# Altium schematic sheet Main.SchDoc
size Tabloid; SheetNumber: 1; SheetTotal: 1; Sheet_Name: Main schematics file; Size: 11x17
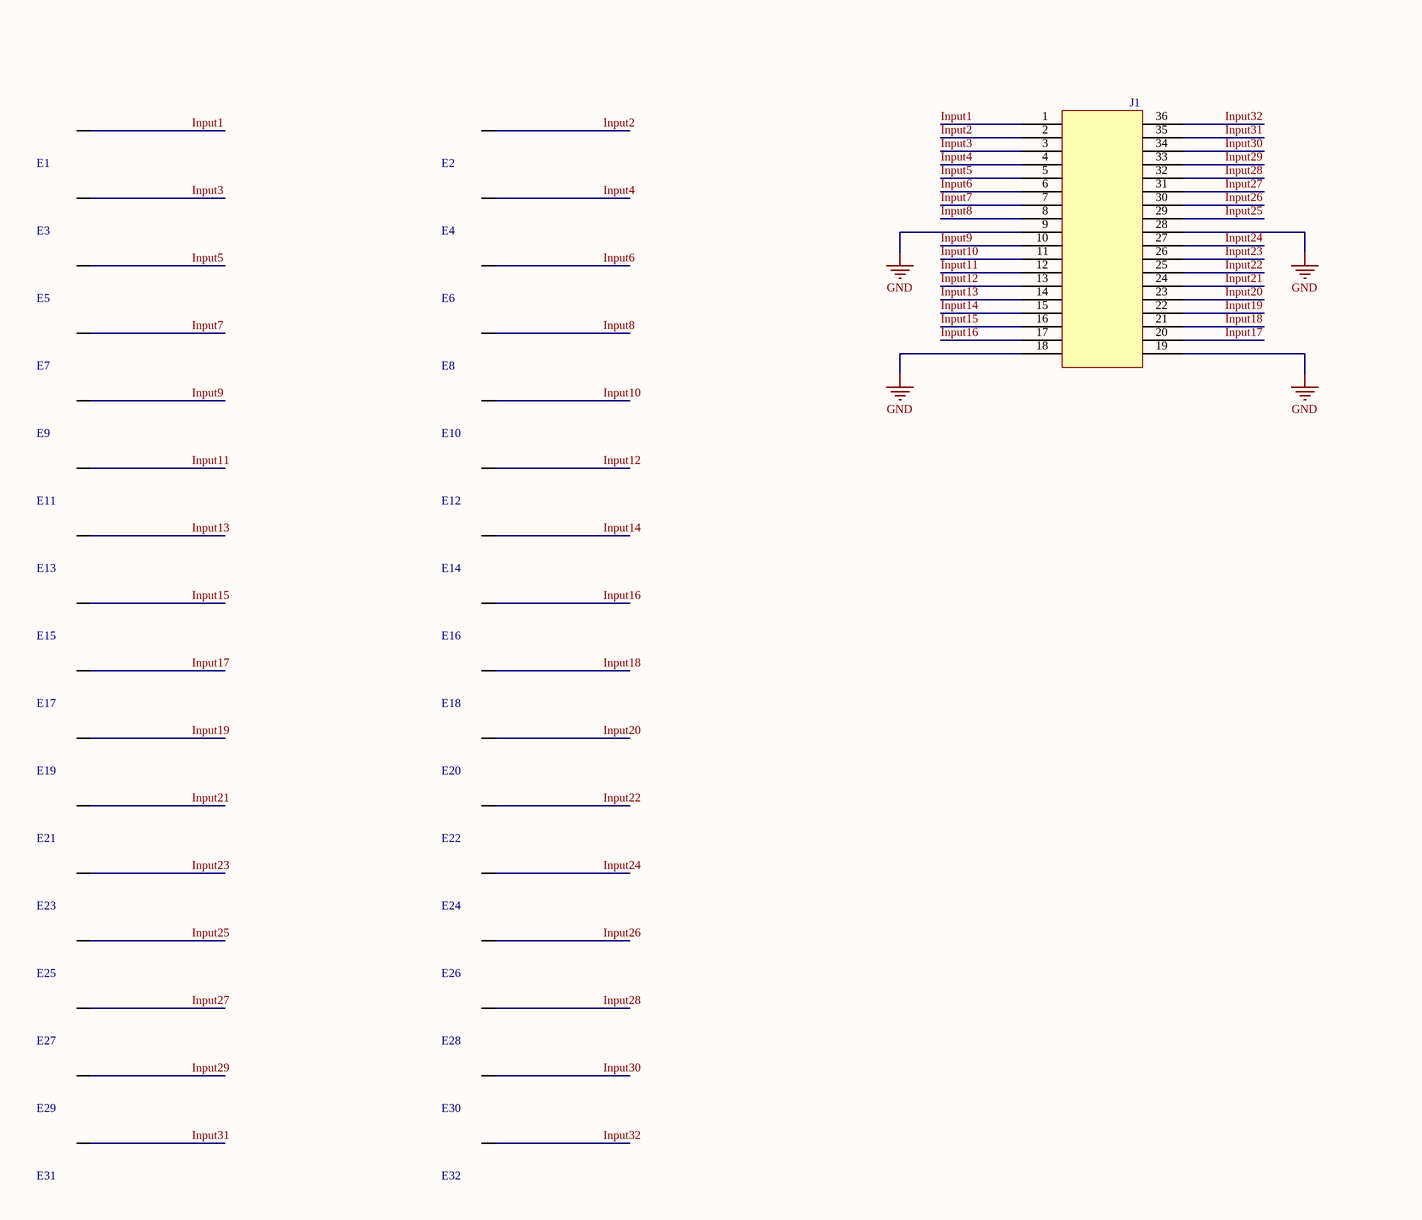
[diagram p0: Main.SchDoc, left]
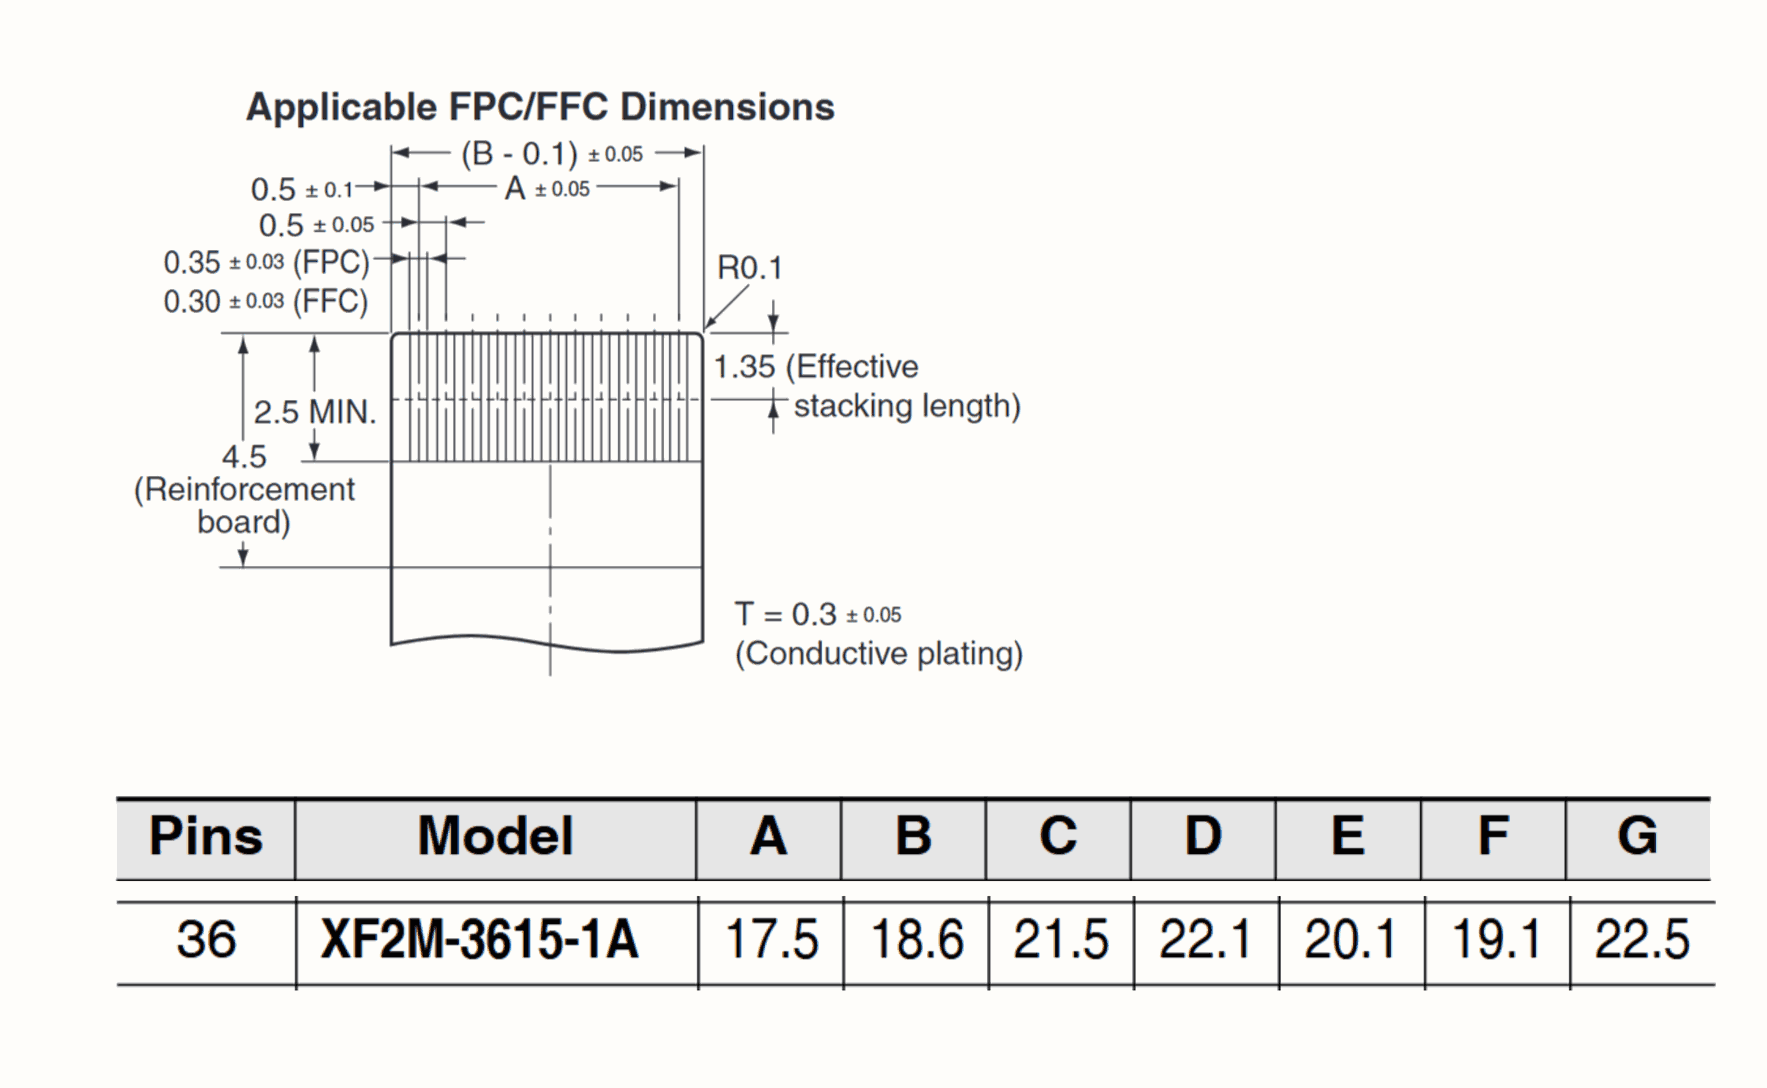
[diagram p1: Main.SchDoc, right]

## Parts
E1  2.5 mm  [PCBComponent_1]  (value not drawn)
E2  2.5 mm  [PCBComponent_1]  (value not drawn)
E3  2.5 mm  [PCBComponent_1]  (value not drawn)
E4  2.5 mm  [PCBComponent_1]  (value not drawn)
E5  2.5 mm  [PCBComponent_1]  (value not drawn)
E6  2.5 mm  [PCBComponent_1]  (value not drawn)
E7  2.5 mm  [PCBComponent_1]  (value not drawn)
E8  2.5 mm  [PCBComponent_1]  (value not drawn)
E9  2.5 mm  [PCBComponent_1]  (value not drawn)
E10  2.5 mm  [PCBComponent_1]  (value not drawn)
E11  2.5 mm  [PCBComponent_1]  (value not drawn)
E12  2.5 mm  [PCBComponent_1]  (value not drawn)
E13  2.5 mm  [PCBComponent_1]  (value not drawn)
E14  2.5 mm  [PCBComponent_1]  (value not drawn)
E15  2.5 mm  [PCBComponent_1]  (value not drawn)
E16  2.5 mm  [PCBComponent_1]  (value not drawn)
E17  2.5 mm  [PCBComponent_1]  (value not drawn)
E18  2.5 mm  [PCBComponent_1]  (value not drawn)
E19  2.5 mm  [PCBComponent_1]  (value not drawn)
E20  2.5 mm  [PCBComponent_1]  (value not drawn)
E21  2.5 mm  [PCBComponent_1]  (value not drawn)
E22  2.5 mm  [PCBComponent_1]  (value not drawn)
E23  2.5 mm  [PCBComponent_1]  (value not drawn)
E24  2.5 mm  [PCBComponent_1]  (value not drawn)
E25  2.5 mm  [PCBComponent_1]  (value not drawn)
E26  2.5 mm  [PCBComponent_1]  (value not drawn)
E27  2.5 mm  [PCBComponent_1]  (value not drawn)
E28  2.5 mm  [PCBComponent_1]  (value not drawn)
E29  2.5 mm  [PCBComponent_1]  (value not drawn)
E30  2.5 mm  [PCBComponent_1]  (value not drawn)
E31  2.5 mm  [PCBComponent_1]  (value not drawn)
E32  2.5 mm  [PCBComponent_1]  (value not drawn)
J1  XF2M-3615-1A  [CONN_FPC_2X18_0MM5]  (value not drawn)

## Nets
GND: J1.9 J1.18 J1.19 J1.28
Input1: E1.1(E) J1.1
Input2: E2.1(E) J1.2
Input3: E3.1(E) J1.3
Input4: E4.1(E) J1.4
Input5: E5.1(E) J1.5
Input6: E6.1(E) J1.6
Input7: E7.1(E) J1.7
Input8: E8.1(E) J1.8
Input9: E9.1(E) J1.10
Input10: E10.1(E) J1.11
Input11: E11.1(E) J1.12
Input12: E12.1(E) J1.13
Input13: E13.1(E) J1.14
Input14: E14.1(E) J1.15
Input15: E15.1(E) J1.16
Input16: E16.1(E) J1.17
Input17: E17.1(E) J1.20
Input18: E18.1(E) J1.21
Input19: E19.1(E) J1.22
Input20: E20.1(E) J1.23
Input21: E21.1(E) J1.24
Input22: E22.1(E) J1.25
Input23: E23.1(E) J1.26
Input24: E24.1(E) J1.27
Input25: E25.1(E) J1.29
Input26: E26.1(E) J1.30
Input27: E27.1(E) J1.31
Input28: E28.1(E) J1.32
Input29: E29.1(E) J1.33
Input30: E30.1(E) J1.34
Input31: E31.1(E) J1.35
Input32: E32.1(E) J1.36

## Notes on the sheet
- Sheet Name
- Project Title
- Global Project
- Size
- Group
- Revision
- Date
- Sheet
- of
- Filename
- Designers

## Library data of the parts
E1-E32 = SENSE_UNEEDLE: Microneedle electrode - 2.5 mm diameter
J1 = CONN_FPC_2X18_0MM5: FPC Connector - FPC Side. 0.5 mm pitch / Compatible with XF2M-3615-1A; GRAMS Lib Spec: 2.7